# EAGLE schematic microEEG321w (EAGLE 6.5.0)
EEG Processor

## Sheet 1 of 2: Analog Circuitry
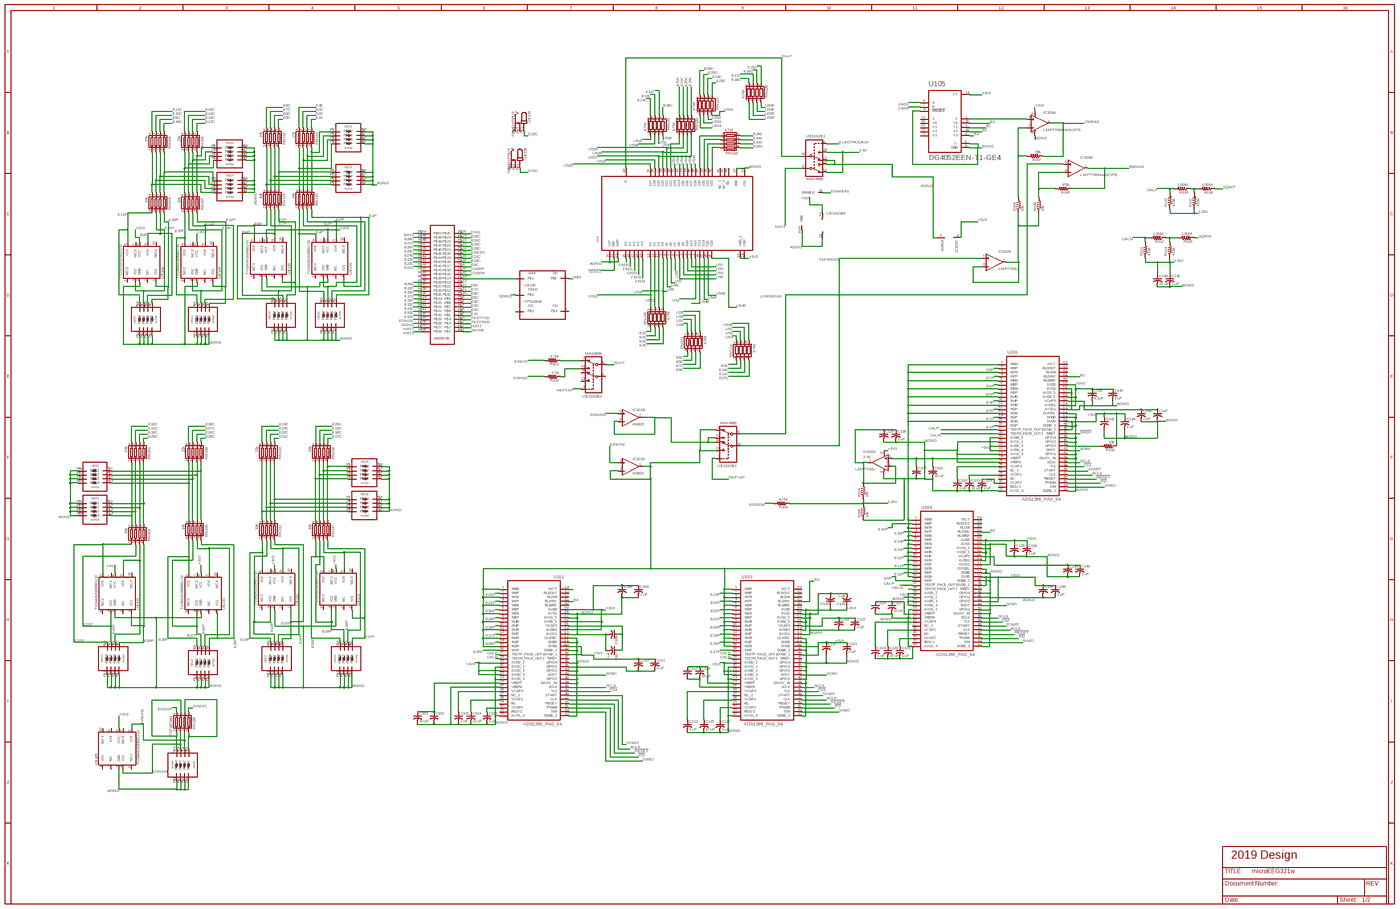
[diagram p0: schematic, sheet 1, overview]
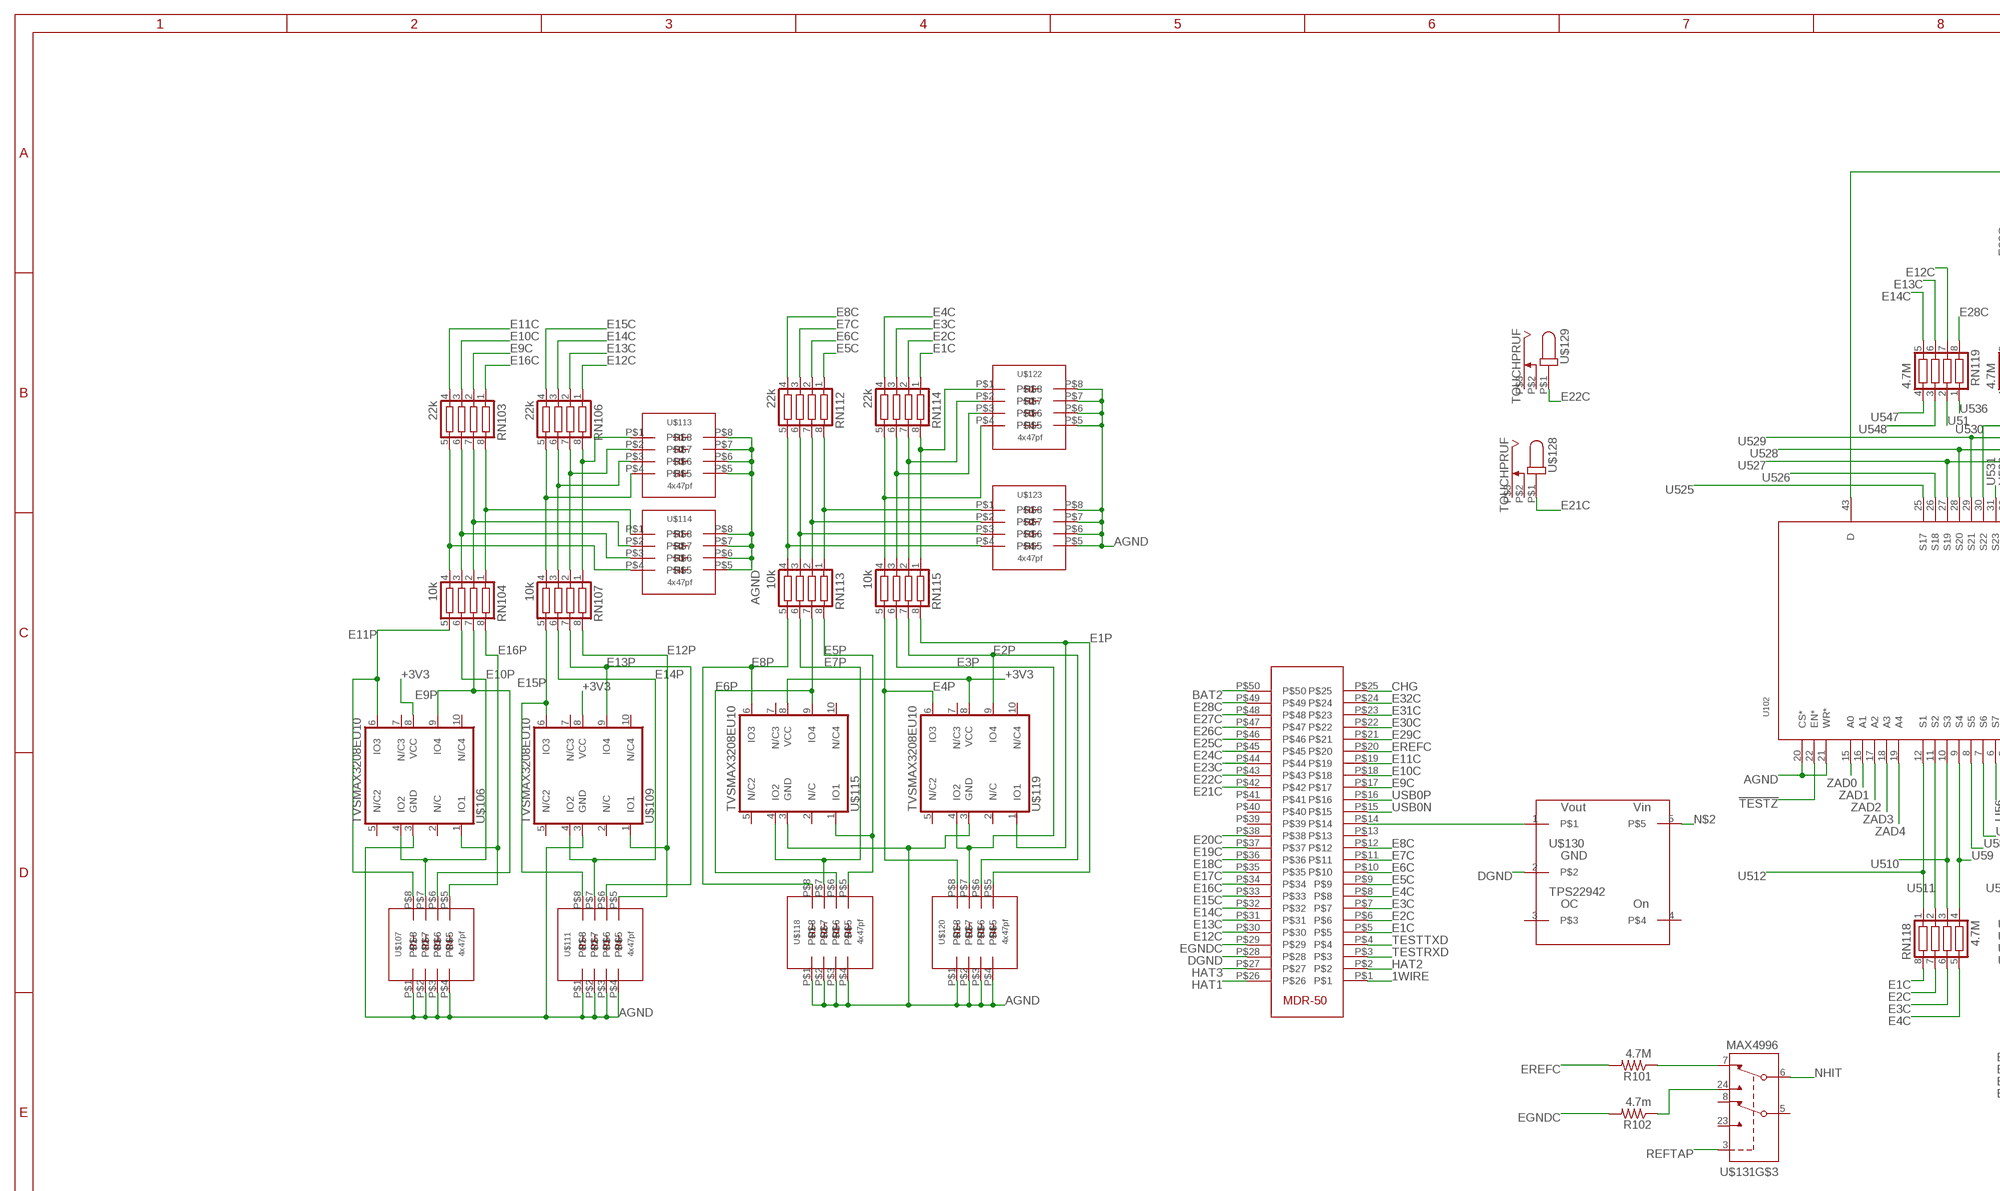
[diagram p1: schematic, sheet 1, part 1 of 4]
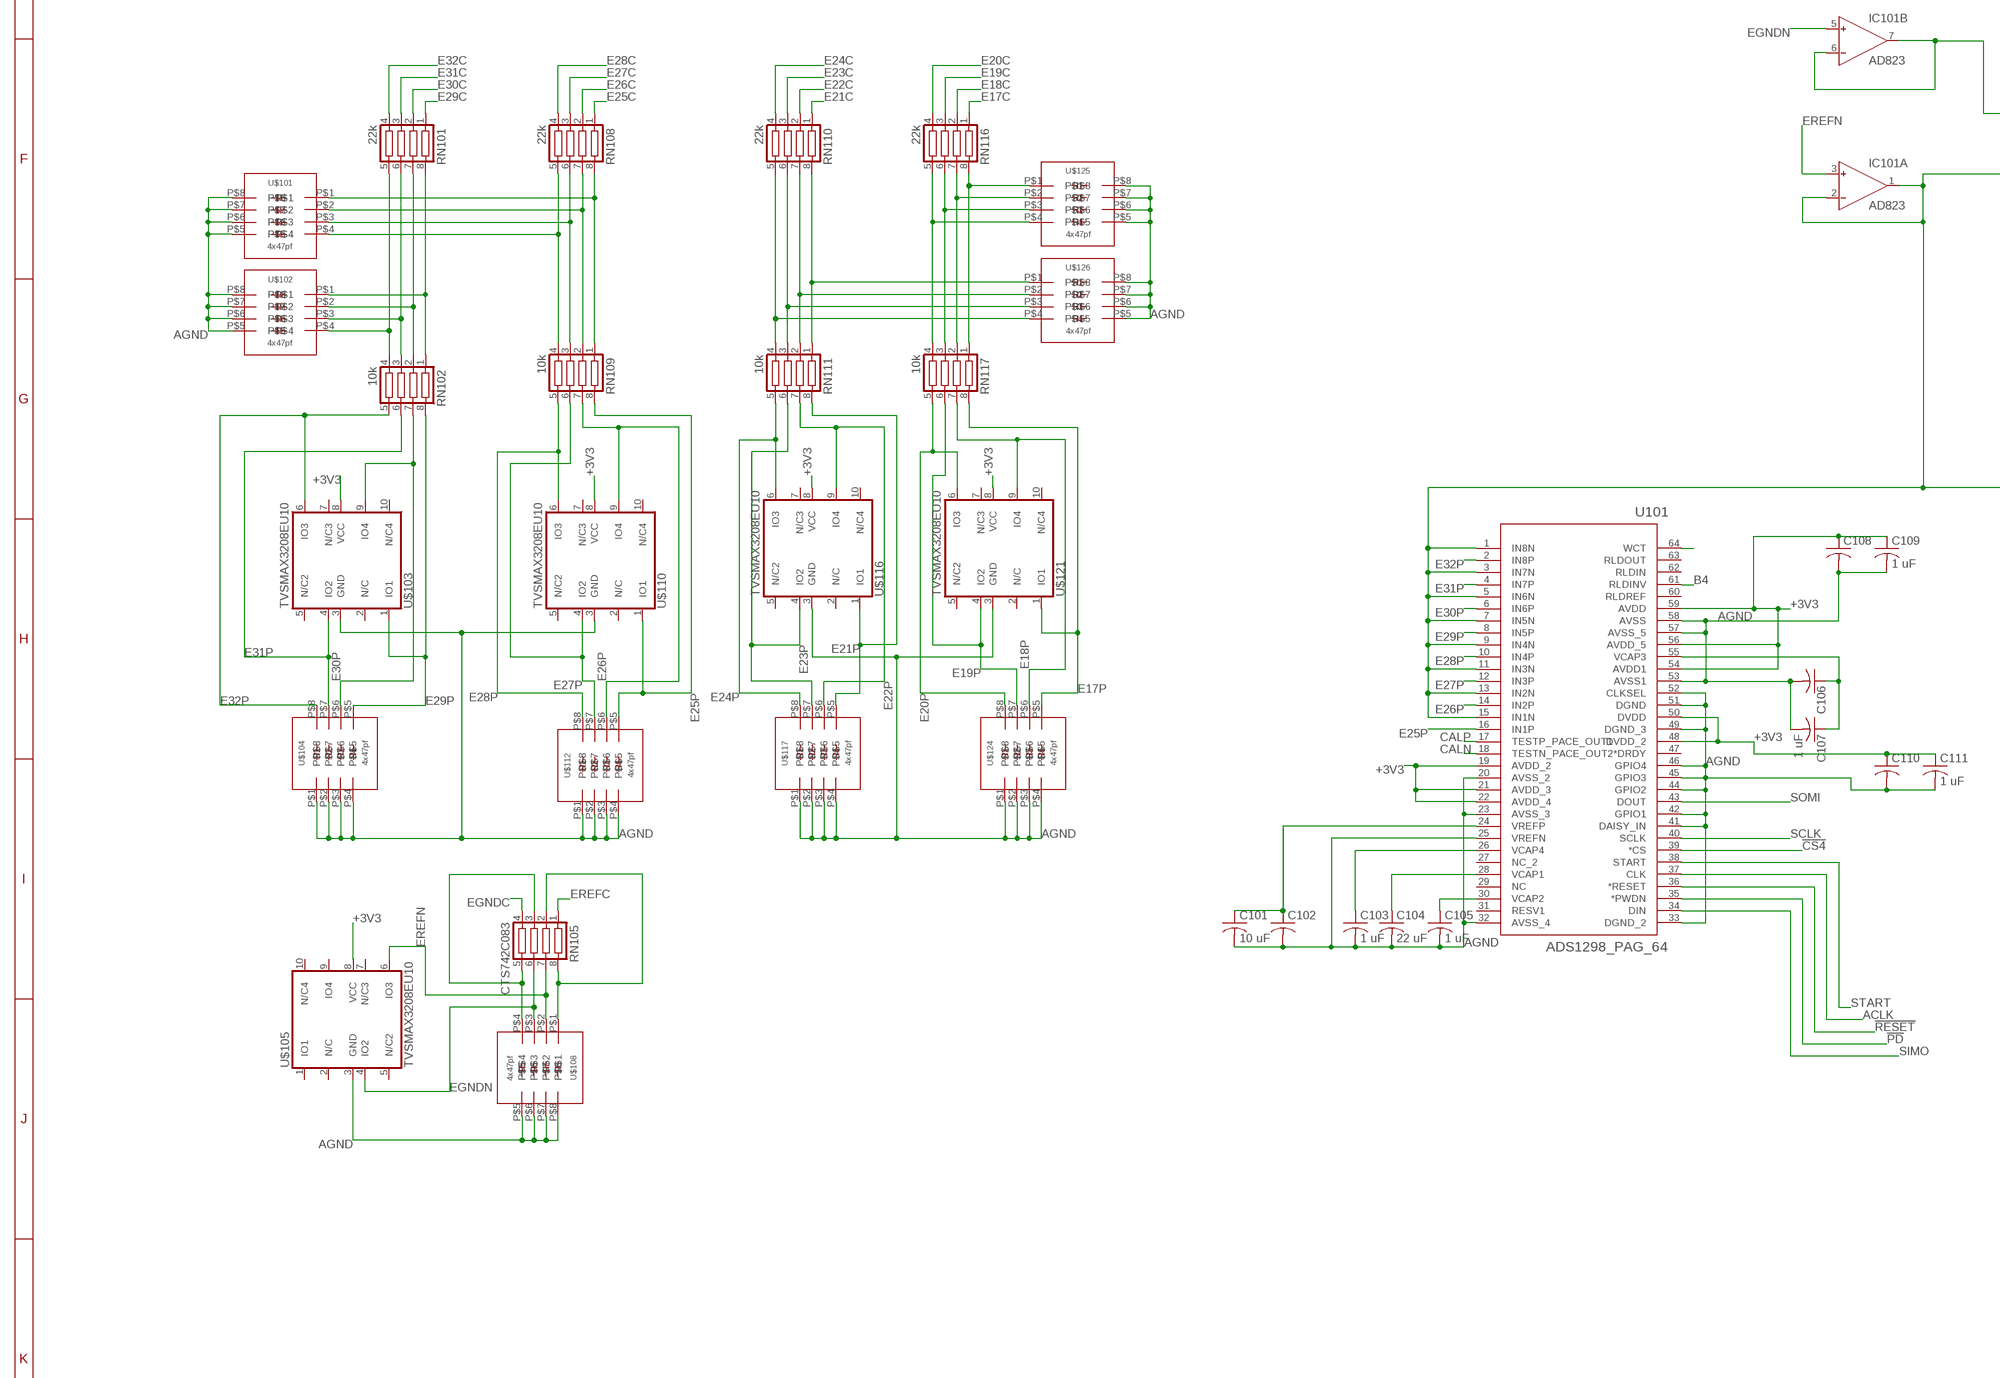
[diagram p2: schematic, sheet 1, part 2 of 4]
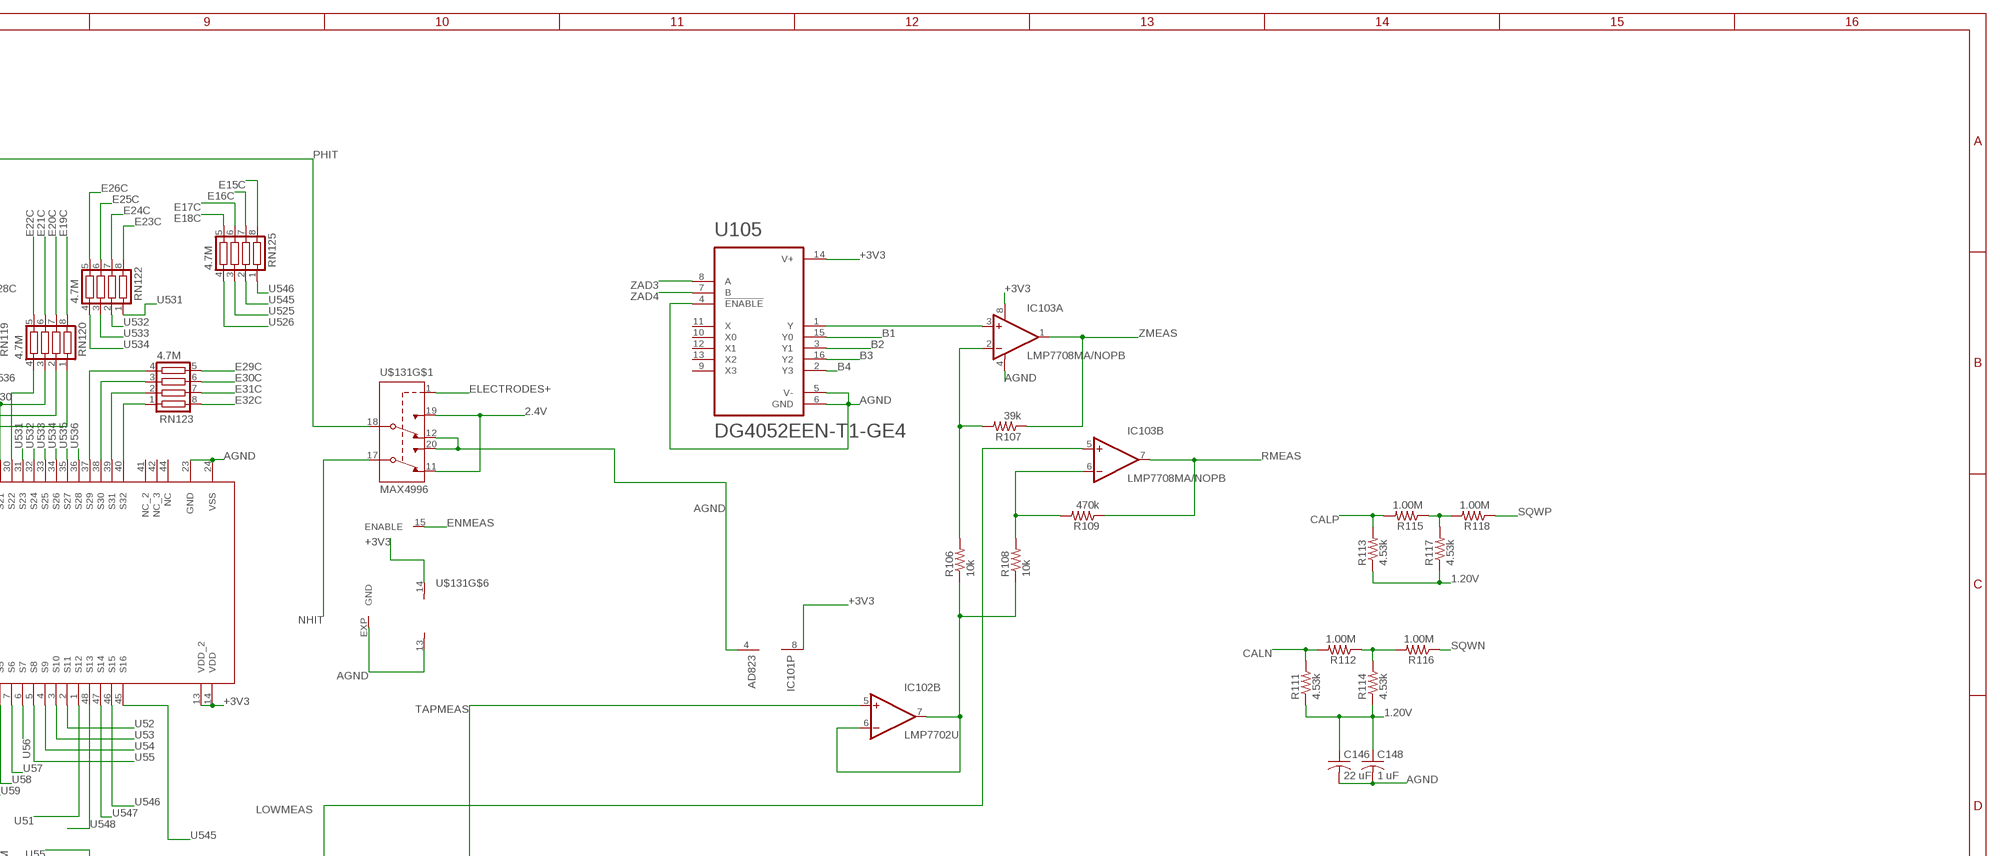
[diagram p3: schematic, sheet 1, part 3 of 4]
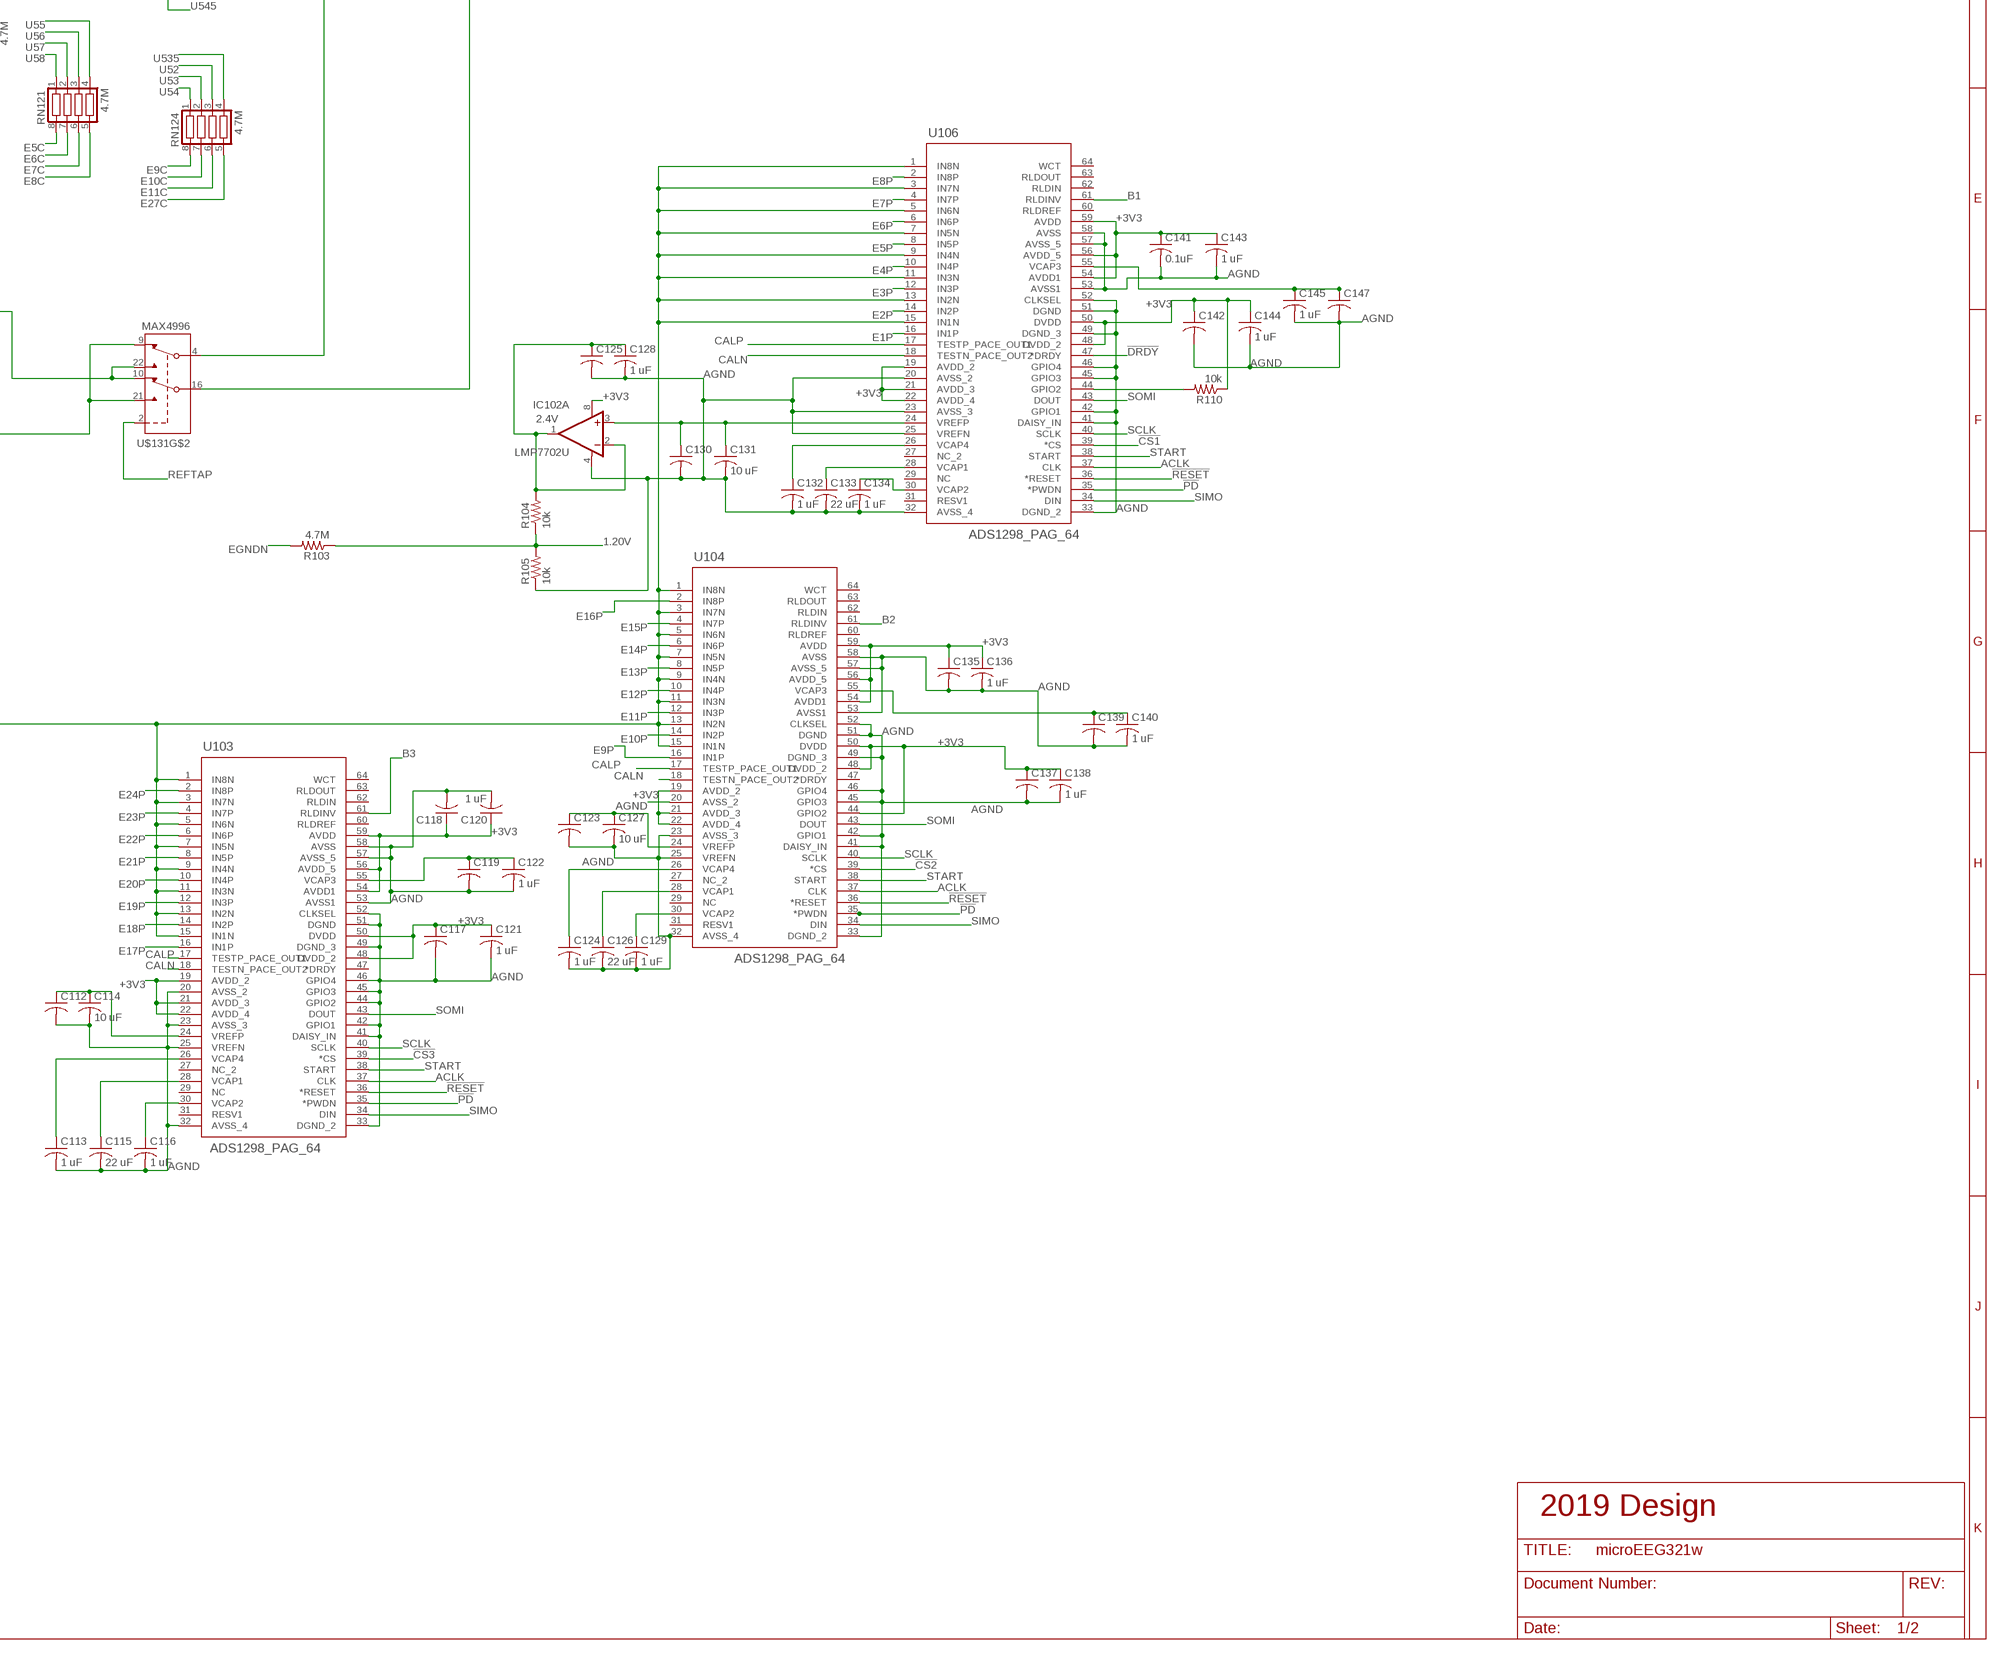
[diagram p4: schematic, sheet 1, part 4 of 4]

### Parts
C101  10 uF  C-USC0402K  [C0402K]
C102  C-USC0402K  [C0402K]
C103  1 uF  C-USC0402K  [C0402K]
C104  22 uF  C-USC0603K  [C0603K]
C105  1 uF  C-USC0402K  [C0402K]
C106  C-USC0402K  [C0402K]
C107  1 uF  C-USC0402K  [C0402K]
C108  C-USC0402K  [C0402K]
C109  1 uF  C-USC0402K  [C0402K]
C110  C-USC0402K  [C0402K]
C111  1 uF  C-USC0402K  [C0402K]
C112  C-USC0402K  [C0402K]
C113  1 uF  C-USC0402K  [C0402K]
C114  10 uF  C-USC0402K  [C0402K]
C115  22 uF  C-USC0603  [C0603]
C116  1 uF  C-USC0402K  [C0402K]
C117  C-USC0402K  [C0402K]
C118  C-USC0402K  [C0402K]
C119  C-USC0402K  [C0402K]
C120  1 uF  C-USC0402K  [C0402K]
C121  1 uF  C-USC0402K  [C0402K]
C122  1 uF  C-USC0402K  [C0402K]
C123  C-USC0402K  [C0402K]
C124  1 uF  C-USC0402K  [C0402K]
C125  C-USC0402K  [C0402K]
C126  22 uF  C-USC0603  [C0603]
C127  10 uF  C-USC0402K  [C0402K]
C128  1 uF  C-USC0402K  [C0402K]
C129  1 uF  C-USC0402K  [C0402K]
C130  C-USC0402K  [C0402K]
C131  10 uF  C-USC0805  [C0805]
C132  1 uF  C-USC0402K  [C0402K]
C133  22 uF  C-USC0603  [C0603]
C134  1 uF  C-USC0402K  [C0402K]
C135  C-USC0402K  [C0402K]
C136  1 uF  C-USC0402K  [C0402K]
C137  C-USC0402K  [C0402K]
C138  1 uF  C-USC0402K  [C0402K]
C139  C-USC0402K  [C0402K]
C140  1 uF  C-USC0402K  [C0402K]
C141  0.1uF  C-USC0402K  [C0402K]
C142  C-USC0402K  [C0402K]
C143  1 uF  C-USC0402K  [C0402K]
C144  1 uF  C-USC0402K  [C0402K]
C145  1 uF  C-USC0402K  [C0402K]
C146  22 uF  C-USC0603  [C0603]
C147  C-USC0402K  [C0402K]
C148  1 uF  C-USC0402  [C0402]
IC101  AD823  [MSOP08]
IC102  LMP7702U  [SO08]
IC103  LMP7708MA/NOPB  LMP7708U  [SO08]
R101  4.7M  R-US_R0402  [R0402]
R102  4.7m  R-US_R0402  [R0402]
R103  4.7M  R-US_R0402  [R0402]
R104  10k  R-US_R0402  [R0402]
R105  10k  R-US_R0402  [R0402]
R106  10k  R-US_R0402  [R0402]
R107  39k  R-US_R0805  [R0805]
R108  10k  R-US_R0402  [R0402]
R109  470k  R-US_R0805  [R0805]
R110  10k  R-US_R0402  [R0402]
R111  4.53k  R-US_R0805  [R0805]
R112  1.00M  R-US_R0402  [R0402]
R113  4.53k  R-US_R0805  [R0805]
R114  4.53k  R-US_R0805  [R0805]
R115  1.00M  R-US_R0402  [R0402]
R116  1.00M  R-US_R0402  [R0402]
R117  4.53k  R-US_R0805  [R0805]
R118  1.00M  R-US_R0402  [R0402]
RN101  22k  CTS742C083  [CTS742C083]
RN102  10k  CTS742C083  [CTS742C083]
RN103  22k  CTS742C083  [CTS742C083]
RN104  10k  CTS742C083  [CTS742C083]
RN105  CTS742C083  [CTS742C083]
RN106  22k  CTS742C083  [CTS742C083]
RN107  10k  CTS742C083  [CTS742C083]
RN108  22k  CTS742C083  [CTS742C083]
RN109  10k  CTS742C083  [CTS742C083]
RN110  22k  CTS742C083  [CTS742C083]
RN111  10k  CTS742C083  [CTS742C083]
RN112  22k  CTS742C083  [CTS742C083]
RN113  10k  CTS742C083  [CTS742C083]
RN114  22k  CTS742C083  [CTS742C083]
RN115  10k  CTS742C083  [CTS742C083]
RN116  22k  CTS742C083  [CTS742C083]
RN117  10k  CTS742C083  [CTS742C083]
RN118  4.7M  CTS742C083  [CTS742C083]
RN119  4.7M  CTS742C083  [CTS742C083]
RN120  4.7M  CTS742C083  [CTS742C083]
RN121  4.7M  CTS742C083  [CTS742C083]
RN122  4.7M  CTS742C083  [CTS742C083]
RN123  4.7M  CTS742C083  [CTS742C083]
RN124  4.7M  CTS742C083  [CTS742C083]
RN125  4.7M  CTS742C083  [CTS742C083]
U101  ADS1298_PAG_64  [PAG64]
U102  ADG732BSUZ  [SU_48]
U103  ADS1298_PAG_64  [PAG64]
U104  ADS1298_PAG_64  [PAG64]
U105  DG4052EEN-T1-GE4  [QFN40P260X180X60-16N]
U106  ADS1298_PAG_64  [PAG64]
U$101  4x47pf  CAP-AVX05084  [CAP0508X4]
U$102  4x47pf  CAP-AVX05084  [CAP0508X4]
U$103  TVSMAX3208EU10  [UMAX10]
U$104  4x47pf  CAP-AVX05084  [CAP0508X4]
U$105  TVSMAX3208EU10  [UMAX10]
U$106  TVSMAX3208EU10  [UMAX10]
U$107  4x47pf  CAP-AVX05084  [CAP0508X4]
U$108  4x47pf  CAP-AVX05084  [CAP0508X4]
U$109  TVSMAX3208EU10  [UMAX10]
U$110  TVSMAX3208EU10  [UMAX10]
U$111  4x47pf  CAP-AVX05084  [CAP0508X4]
U$112  4x47pf  CAP-AVX05084  [CAP0508X4]
U$113  4x47pf  CAP-AVX05084  [CAP0508X4]
U$114  4x47pf  CAP-AVX05084  [CAP0508X4]
U$115  TVSMAX3208EU10  [UMAX10]
U$116  TVSMAX3208EU10  [UMAX10]
U$117  4x47pf  CAP-AVX05084  [CAP0508X4]
U$118  4x47pf  CAP-AVX05084  [CAP0508X4]
U$119  TVSMAX3208EU10  [UMAX10]
U$120  4x47pf  CAP-AVX05084  [CAP0508X4]
U$121  TVSMAX3208EU10  [UMAX10]
U$122  4x47pf  CAP-AVX05084  [CAP0508X4]
U$123  4x47pf  CAP-AVX05084  [CAP0508X4]
U$124  4x47pf  CAP-AVX05084  [CAP0508X4]
U$125  4x47pf  CAP-AVX05084  [CAP0508X4]
U$126  4x47pf  CAP-AVX05084  [CAP0508X4]
U$127  PNLRECEPT  [THROUGHHOLERECEPT]
U$128  TOUCHPRUF  [TOUCHPROOF]
U$129  TOUCHPRUF  [TOUCHPROOF]
U$130  TPS22942  [DCK]
U$131  MAX4996  [TQFN24-EP]

### Nets
1.20V: C146.1 C148.1 R103.1 R104.1 R105.2 R111.1 R113.1 R114.1 R117.1
1WIRE: U$127.P$1 ; also sheet 2
2.4V: C125.1 C128.1 IC102.1(A:OUT) IC102.2(A:-IN) R104.2 U$131.11(NC2) U$131.19(NO1) ; also sheet 2
!CS1!: U106.39(*CS) ; also sheet 2
!CS2!: U104.39(*CS) ; also sheet 2
!CS3!: U103.39(*CS) ; also sheet 2
!CS4!: U101.39(*CS) ; also sheet 2
!DRDY!: U106.47(*DRDY) ; also sheet 2
!PD!: U101.35(*PWDN) U103.35(*PWDN) U104.35(*PWDN) U106.35(*PWDN) ; also sheet 2
!RESET!: U101.36(*RESET) U103.36(*RESET) U104.36(*RESET) U106.36(*RESET) ; also sheet 2
!TESTZ!: U102.22(EN*) ; also sheet 2
+3V3: C108.1 C109.1 C110.1 C111.1 C117.1 C118.1 C120.1 C121.1 C135.1 C136.1 C137.1 C138.1 C141.1 C142.1 C143.1 C144.1 IC101.8(P:V+) IC102.8(A:V+) IC103.8(A:V+) R110.1 U101.19(AVDD_2) U101.21(AVDD_3) U101.22(AVDD_4) U101.48(DVDD_2) U101.50(DVDD) U101.54(AVDD1) U101.56(AVDD_5) U101.59(AVDD) U102.13(VDD_2) U102.14(VDD) U103.19(AVDD_2) U103.21(AVDD_3) U103.22(AVDD_4) U103.48(DVDD_2) U103.50(DVDD) U103.54(AVDD1) U103.56(AVDD_5) U103.59(AVDD) U104.19(AVDD_2) U104.21(AVDD_3) U104.22(AVDD_4) U104.44(GPIO2) U104.48(DVDD_2) U104.50(DVDD) U104.54(AVDD1) U104.56(AVDD_5) U104.59(AVDD) U105.14(V+) U106.19(AVDD_2) U106.21(AVDD_3) U106.22(AVDD_4) U106.48(DVDD_2) U106.50(DVDD) U106.54(AVDD1) U106.56(AVDD_5) U106.59(AVDD) U$103.8(VCC) U$105.8(VCC) U$106.8(VCC) U$109.8(VCC) U$110.8(VCC) U$115.8(VCC) U$116.8(VCC) U$119.8(VCC) U$121.8(VCC) U$131.14(V+) ; also sheet 2
ACLK: U101.37(CLK) U103.37(CLK) U104.37(CLK) U106.37(CLK) ; also sheet 2
AGND: C101.2 C102.2 C103.2 C104.2 C105.2 C106.2 C107.2 C108.2 C109.2 C110.2 C111.2 C112.2 C113.2 C114.2 C115.2 C116.2 C117.2 C118.2 C119.2 C120.2 C121.2 C122.2 C123.2 C124.2 C125.2 C126.2 C127.2 C128.2 C129.2 C130.2 C131.2 C132.2 C133.2 C134.2 C135.2 C136.2 C137.2 C138.2 C139.2 C140.2 C141.2 C142.2 C143.2 C144.2 C145.2 C146.2 C147.2 C148.2 IC101.4(P:V-) IC102.4(A:V-) IC103.4(A:V-) R105.1 U101.20(AVSS_2) U101.23(AVSS_3) U101.25(VREFN) U101.32(AVSS_4) U101.33(DGND_2) U101.41(DAISY_IN) U101.42(GPIO1) U101.44(GPIO2) U101.45(GPIO3) U101.46(GPIO4) U101.49(DGND_3) U101.51(DGND) U101.52(CLKSEL) U101.53(AVSS1) U101.57(AVSS_5) U101.58(AVSS) U102.20(CS*) U102.21(WR*) U102.23(GND) U102.24(VSS) U103.20(AVSS_2) U103.23(AVSS_3) U103.25(VREFN) U103.32(AVSS_4) U103.33(DGND_2) U103.41(DAISY_IN) U103.42(GPIO1) U103.44(GPIO2) U103.45(GPIO3) U103.46(GPIO4) U103.49(DGND_3) U103.51(DGND) U103.52(CLKSEL) U103.53(AVSS1) U103.57(AVSS_5) U103.58(AVSS) U104.20(AVSS_2) U104.23(AVSS_3) U104.25(VREFN) U104.32(AVSS_4) U104.33(DGND_2) U104.41(DAISY_IN) U104.42(GPIO1) U104.45(GPIO3) U104.46(GPIO4) U104.49(DGND_3) U104.51(DGND) U104.52(CLKSEL) U104.53(AVSS1) U104.57(AVSS_5) U104.58(AVSS) U105.4(!ENABLE) U105.5(V-) U105.6(GND) U106.20(AVSS_2) U106.23(AVSS_3) U106.25(VREFN) U106.32(AVSS_4) U106.33(DGND_2) U106.41(DAISY_IN) U106.42(GPIO1) U106.45(GPIO3) U106.46(GPIO4) U106.49(DGND_3) U106.51(DGND) U106.52(CLKSEL) U106.53(AVSS1) U106.57(AVSS_5) U106.58(AVSS) U$101.P$5 U$101.P$6 U$101.P$7 U$101.P$8 U$102.P$5 U$102.P$6 U$102.P$7 U$102.P$8 U$103.3(GND) U$104.P$1 U$104.P$2 U$104.P$3 U$104.P$4 U$105.3(GND) U$106.3(GND) U$107.P$1 U$107.P$2 U$107.P$3 U$107.P$4 U$108.P$5 U$108.P$6 U$108.P$7 U$108.P$8 U$109.3(GND) U$110.3(GND) U$111.P$1 U$111.P$2 U$111.P$3 U$111.P$4 U$112.P$1 U$112.P$2 U$112.P$3 U$112.P$4 U$113.P$5 U$113.P$6 U$113.P$7 U$113.P$8 U$114.P$5 U$114.P$6 U$114.P$7 U$114.P$8 U$115.3(GND) U$116.3(GND) U$117.P$1 U$117.P$2 U$117.P$3 U$117.P$4 U$118.P$1 U$118.P$2 U$118.P$3 U$118.P$4 U$119.3(GND) U$120.P$1 U$120.P$2 U$120.P$3 U$120.P$4 U$121.3(GND) U$122.P$5 U$122.P$6 U$122.P$7 U$122.P$8 U$123.P$5 U$123.P$6 U$123.P$7 U$123.P$8 U$124.P$1 U$124.P$2 U$124.P$3 U$124.P$4 U$125.P$5 U$125.P$6 U$125.P$7 U$125.P$8 U$126.P$5 U$126.P$6 U$126.P$7 U$126.P$8 U$131.12(NC1) U$131.13(V-) U$131.20(NO2) U$131.EXP(GND) ; also sheet 2
B1: U105.15(Y0) U106.61(RLDINV)
B2: U104.61(RLDINV) U105.3(Y1)
B3: U103.61(RLDINV) U105.16(Y2)
B4: U101.61(RLDINV) U105.2(Y3)
BAT2: U$127.P$50 ; also sheet 2
CALN: R111.2 R112.2 U101.18(TESTN_PACE_OUT2) U103.18(TESTN_PACE_OUT2) U104.18(TESTN_PACE_OUT2) U106.18(TESTN_PACE_OUT2)
CALP: R113.2 R115.2 U101.17(TESTP_PACE_OUT1) U103.17(TESTP_PACE_OUT1) U104.17(TESTP_PACE_OUT1) U106.17(TESTP_PACE_OUT1)
CHG: U$127.P$25 ; also sheet 2
DGND: U$127.P$28 U$130.2 ; also sheet 2
E1C: RN114.1 RN118.8 U$127.P$5
E1P: RN115.8 U106.16(IN1P) U$119.1(IO1) U$120.P$5
E2C: RN114.2 RN118.7 U$127.P$6
E2P: RN115.7 U106.14(IN2P) U$119.9(IO4) U$120.P$6
E3C: RN114.3 RN118.6 U$127.P$7
E3P: RN115.6 U106.12(IN3P) U$119.4(IO2) U$120.P$7
E4C: RN114.4 RN118.5 U$127.P$8
E4P: RN115.5 U106.10(IN4P) U$119.6(IO3) U$120.P$8
E5C: RN112.1 RN121.8 U$127.P$9
E5P: RN113.8 U106.8(IN5P) U$115.1(IO1) U$118.P$5
E6C: RN112.2 RN121.7 U$127.P$10
E6P: RN113.7 U106.6(IN6P) U$115.9(IO4) U$118.P$6
E7C: RN112.3 RN121.6 U$127.P$11
E7P: RN113.6 U106.4(IN7P) U$115.4(IO2) U$118.P$7
E8C: RN112.4 RN121.5 U$127.P$12
E8P: RN113.5 U106.2(IN8P) U$115.6(IO3) U$118.P$8
E9C: RN103.2 RN124.8 U$127.P$17
E9P: RN104.7 U104.16(IN1P) U$106.9(IO4) U$107.P$6
E10C: RN103.3 RN124.7 U$127.P$18
E10P: RN104.6 U104.14(IN2P) U$106.4(IO2) U$107.P$7
E11C: RN103.4 RN124.6 U$127.P$19
E11P: RN104.5 U104.12(IN3P) U$106.6(IO3) U$107.P$8
E12C: RN106.1 RN119.7 U$127.P$30
E12P: RN107.8 U104.10(IN4P) U$109.1(IO1) U$111.P$5
E13C: RN106.2 RN119.6 U$127.P$31
E13P: RN107.7 U104.8(IN5P) U$109.9(IO4) U$111.P$6
E14C: RN106.3 RN119.5 U$127.P$32
E14P: RN107.6 U104.6(IN6P) U$109.4(IO2) U$111.P$7
E15C: RN106.4 RN125.8 U$127.P$33
E15P: RN107.5 U104.4(IN7P) U$109.6(IO3) U$111.P$8
E16C: RN103.1 RN125.7 U$127.P$34
E16P: RN104.8 U104.2(IN8P) U$106.1(IO1) U$107.P$5
E17C: RN116.1 RN125.6 U$127.P$35
E17P: RN117.8 U103.16(IN1P) U$121.1(IO1) U$124.P$5
E18C: RN116.2 RN125.5 U$127.P$36
E18P: RN117.7 U103.14(IN2P) U$121.9(IO4) U$124.P$6
E19C: RN116.3 RN120.8 U$127.P$37
E19P: RN117.6 U103.12(IN3P) U$121.4(IO2) U$124.P$7
E20C: RN116.4 RN120.7 U$127.P$38
E20P: RN117.5 U103.10(IN4P) U$121.6(IO3) U$124.P$8
E21C: RN110.1 RN120.6 U$127.P$42 U$128.P$1
E21P: RN111.8 U103.8(IN5P) U$116.1(IO1) U$117.P$5
E22C: RN110.2 RN120.5 U$127.P$43 U$129.P$1
E22P: RN111.7 U103.6(IN6P) U$116.9(IO4) U$117.P$6
E23C: RN110.3 RN122.8 U$127.P$44
E23P: RN111.6 U103.4(IN7P) U$116.4(IO2) U$117.P$7
E24C: RN110.4 RN122.7 U$127.P$45
E24P: RN111.5 U103.2(IN8P) U$116.6(IO3) U$117.P$8
E25C: RN108.1 RN122.6 U$127.P$46
E25P: RN109.8 U101.16(IN1P) U$110.1(IO1) U$112.P$5
E26C: RN108.2 RN122.5 U$127.P$47
E26P: RN109.7 U101.14(IN2P) U$110.9(IO4) U$112.P$6
E27C: RN108.3 RN124.5 U$127.P$48
E27P: RN109.6 U101.12(IN3P) U$110.4(IO2) U$112.P$7
E28C: RN108.4 RN119.8 U$127.P$49
E28P: RN109.5 U101.10(IN4P) U$110.6(IO3) U$112.P$8
E29C: RN101.1 RN123.5 U$127.P$21
E29P: RN102.8 U101.8(IN5P) U$103.1(IO1) U$104.P$5
E30C: RN101.2 RN123.6 U$127.P$22
E30P: RN102.7 U101.6(IN6P) U$103.9(IO4) U$104.P$6
E31C: RN101.3 RN123.7 U$127.P$23
E31P: RN102.6 U101.4(IN7P) U$103.4(IO2) U$104.P$7
E32C: RN101.4 RN123.8 U$127.P$24
E32P: RN102.5 U101.2(IN8P) U$103.6(IO3) U$104.P$8
EGNDC: R102.2 RN105.4 U$127.P$29
EGNDN: IC101.5(B:IN+) R103.2 RN105.6 U$105.4(IO2) U$108.P$3
ELECTRODES+: U$131.1(CB) ; also sheet 2
ENMEAS: U$131.15(ENABLE) ; also sheet 2
EREFC: R101.2 RN105.1 U$127.P$20
EREFN: IC101.3(A:IN+) RN105.7 U$105.6(IO3) U$108.P$2
HAT1: U$127.P$26 ; also sheet 2
HAT2: U$127.P$2 ; also sheet 2
HAT3: U$127.P$27 ; also sheet 2
LOWMEAS: IC103.5(B:+IN) U$131.4(COM2)
N$1: R110.2 U106.44(GPIO2)
N$2: U$130.5 ; also sheet 2
N$6: R101.1 U$131.7(NC2)
N$7: IC103.3(A:+IN) U105.1(Y)
N$8: R102.1 U$131.24(NO2)
N$9: RN112.5 RN113.4 U$123.P$4
N$10: IC101.6(B:IN-) IC101.7(B:OUT) U$131.10(NC1) U$131.22(NO2)
N$16: RN123.4 U102.37(S29)
N$17: RN112.6 RN113.3 U$123.P$3
N$18: RN112.7 RN113.2 U$123.P$2
N$21: RN123.3 U102.38(S30)
N$22: RN123.2 U102.39(S31)
N$23: RN123.1 U102.40(S32)
N$24: RN112.8 RN113.1 U$123.P$1
N$31: RN105.2 RN105.8 U$108.P$1
N$32: RN106.8 RN107.1 U$113.P$1
N$33: RN106.7 RN107.2 U$113.P$2
N$34: RN106.6 RN107.3 U$113.P$3
N$36: RN106.5 RN107.4 U$113.P$4
N$37: RN103.8 RN104.1 U$114.P$1
N$38: RN114.8 RN115.1 U$122.P$1
N$39: RN114.7 RN115.2 U$122.P$2
N$40: RN114.6 RN115.3 U$122.P$3
N$41: RN114.5 RN115.4 U$122.P$4
N$44: RN103.7 RN104.2 U$114.P$2
N$45: RN103.6 RN104.3 U$114.P$3
N$46: RN103.5 RN104.4 U$114.P$4
N$55: C130.1 C131.1 IC102.3(A:+IN) U106.24(VREFP)
N$58: RN116.8 RN117.1 U$125.P$1
N$59: RN116.7 RN117.2 U$125.P$2
N$60: RN116.6 RN117.3 U$125.P$3
N$61: RN116.5 RN117.4 U$125.P$4
N$62: IC102.6(B:-IN) IC102.7(B:OUT) R106.1 R108.1
N$63: IC103.6(B:-IN) R108.2 R109.2
N$64: IC103.2(A:-IN) R106.2 R107.2
N$65: RN101.5 RN102.4 U$102.P$4
N$69: C105.1 U101.30(VCAP2)
N$70: C145.1 C147.1 U106.55(VCAP3)
N$71: C101.1 C102.1 U101.24(VREFP)
N$72: RN110.8 RN111.1 U$126.P$1
N$73: RN110.7 RN111.2 U$126.P$2
N$74: RN110.6 RN111.3 U$126.P$3
N$75: C104.1 U101.28(VCAP1)
N$76: C106.1 C107.1 U101.55(VCAP3)
N$77: C103.1 U101.26(VCAP4)
N$78: C116.1 U103.30(VCAP2)
N$79: C115.1 U103.28(VCAP1)
N$80: C113.1 U103.26(VCAP4)
N$81: C123.1 C127.1 U104.24(VREFP)
N$82: C129.1 U104.30(VCAP2)
N$83: C126.1 U104.28(VCAP1)
N$84: C124.1 U104.26(VCAP4)
N$85: C134.1 U106.30(VCAP2)
N$86: C133.1 U106.28(VCAP1)
N$87: C132.1 U106.26(VCAP4)
N$90: RN110.5 RN111.4 U$126.P$4
N$92: RN101.6 RN102.3 U$102.P$3
N$93: RN101.7 RN102.2 U$102.P$2
N$95: RN101.8 RN102.1 U$102.P$1
N$96: RN108.5 RN109.4 U$101.P$4
N$99: RN108.6 RN109.3 U$101.P$3
N$104: RN108.7 RN109.2 U$101.P$2
N$107: RN108.8 RN109.1 U$101.P$1
N$111: R115.1 R117.2 R118.2
N$112: R112.1 R114.2 R116.2
N$130: C139.1 C140.1 U104.55(VCAP3)
N$132: U$127.P$14 U$130.1
N$133: C112.1 C114.1 U103.24(VREFP)
N$145: C119.1 C122.1 U103.55(VCAP3)
N$147: RN105.3 RN105.5 U$108.P$4
NCOMM: IC101.1(A:OUT) IC101.2(A:IN-) U101.1(IN8N) U101.3(IN7N) U101.5(IN6N) U101.7(IN5N) U101.9(IN4N) U101.11(IN3N) U101.13(IN2N) U101.15(IN1N) U103.1(IN8N) U103.3(IN7N) U103.5(IN6N) U103.7(IN5N) U103.9(IN4N) U103.11(IN3N) U103.13(IN2N) U103.15(IN1N) U104.1(IN8N) U104.3(IN7N) U104.5(IN6N) U104.7(IN5N) U104.9(IN4N) U104.11(IN3N) U104.13(IN2N) U104.15(IN1N) U106.1(IN8N) U106.3(IN7N) U106.5(IN6N) U106.7(IN5N) U106.9(IN4N) U106.11(IN3N) U106.13(IN2N) U106.15(IN1N) U$131.9(NC2) U$131.21(NO1)
NHIT: U$131.6(COM2) U$131.17(COM2)
PHIT: U102.43(D) U$131.18(COM1)
REFTAP: U$131.2(CB) U$131.3(CB) ; also sheet 2
RMEAS: IC103.7(B:OUT) R109.1 ; also sheet 2
SCLK: U101.40(SCLK) U103.40(SCLK) U104.40(SCLK) U106.40(SCLK) ; also sheet 2
SIMO: U101.34(DIN) U103.34(DIN) U104.34(DIN) U106.34(DIN) ; also sheet 2
SOMI: U101.43(DOUT) U103.43(DOUT) U104.43(DOUT) U106.43(DOUT) ; also sheet 2
SQWN: R116.1 ; also sheet 2
SQWP: R118.1 ; also sheet 2
START: U101.38(START) U103.38(START) U104.38(START) U106.38(START) ; also sheet 2
TAPMEAS: IC102.5(B:+IN) U$131.16(COM1)
TESTRXD: U$127.P$3 ; also sheet 2
TESTTXD: U$127.P$4 ; also sheet 2
U51: RN119.2 U102.1(S12)
U52: RN124.3 U102.2(S11)
U53: RN124.2 U102.3(S10)
U54: RN124.1 U102.4(S9)
U55: RN121.4 U102.5(S8)
U56: RN121.3 U102.6(S7)
U57: RN121.2 U102.7(S6)
U58: RN121.1 U102.8(S5)
U59: RN118.4 U102.9(S4)
U510: RN118.3 U102.10(S3)
U511: RN118.2 U102.11(S2)
U512: RN118.1 U102.12(S1)
U525: RN125.3 U102.25(S17)
U526: RN125.4 U102.26(S18)
U527: RN120.1 U102.27(S19)
U528: RN120.2 U102.28(S20)
U529: RN120.3 U102.29(S21)
U530: RN120.4 U102.30(S22)
U531: RN122.1 U102.31(S23)
U532: RN122.2 U102.32(S24)
U533: RN122.3 U102.33(S25)
U534: RN122.4 U102.34(S26)
U535: RN124.4 U102.35(S27)
U536: RN119.1 U102.36(S28)
U545: RN125.2 U102.45(S16)
U546: RN125.1 U102.46(S15)
U547: RN119.4 U102.47(S14)
U548: RN119.3 U102.48(S13)
USB0N: U$127.P$15 ; also sheet 2
USB0P: U$127.P$16 ; also sheet 2
WCT: U101.64(WCT)
ZAD0: U102.15(A0) ; also sheet 2
ZAD1: U102.16(A1) ; also sheet 2
ZAD2: U102.17(A2) ; also sheet 2
ZAD3: U102.18(A3) U105.8(A) ; also sheet 2
ZAD4: U102.19(A4) U105.7(B) ; also sheet 2
ZMEAS: IC103.1(A:OUT) R107.1 ; also sheet 2
Unconnected: U101.27(NC_2) U101.29(NC) U101.31(RESV1) U101.47(*DRDY) U101.60(RLDREF) U101.62(RLDIN) U101.63(RLDOUT) U102.41(NC_2) U102.42(NC_3) U102.44(NC) U103.27(NC_2) U103.29(NC) U103.31(RESV1) U103.47(*DRDY) U103.60(RLDREF) U103.62(RLDIN) U103.63(RLDOUT) U103.64(WCT) U104.27(NC_2) U104.29(NC) U104.31(RESV1) U104.47(*DRDY) U104.60(RLDREF) U104.62(RLDIN) U104.63(RLDOUT) U104.64(WCT) U105.9(X3) U105.10(X0) U105.11(X) U105.12(X1) U105.13(X2) U106.27(NC_2) U106.29(NC) U106.31(RESV1) U106.60(RLDREF) U106.62(RLDIN) U106.63(RLDOUT) U106.64(WCT) U$103.2(N/C) U$103.5(N/C2) U$103.7(N/C3) U$103.10(N/C4) U$105.1(IO1) U$105.2(N/C) U$105.5(N/C2) U$105.7(N/C3) U$105.9(IO4) U$105.10(N/C4) U$106.2(N/C) U$106.5(N/C2) U$106.7(N/C3) U$106.10(N/C4) U$109.2(N/C) U$109.5(N/C2) U$109.7(N/C3) U$109.10(N/C4) U$110.2(N/C) U$110.5(N/C2) U$110.7(N/C3) U$110.10(N/C4) U$115.2(N/C) U$115.5(N/C2) U$115.7(N/C3) U$115.10(N/C4) U$116.2(N/C) U$116.5(N/C2) U$116.7(N/C3) U$116.10(N/C4) U$119.2(N/C) U$119.5(N/C2) U$119.7(N/C3) U$119.10(N/C4) U$121.2(N/C) U$121.5(N/C2) U$121.7(N/C3) U$121.10(N/C4) U$127.P$13 U$127.P$39 U$127.P$40 U$127.P$41 U$128.P$2 U$128.P$3 U$129.P$2 U$129.P$3 U$130.3 U$130.4 U$131.5(COM1) U$131.8(NC1) U$131.23(NO1)

### Notes on the sheet
- 2019 Design

## Sheet 2 of 2: Digital Processing
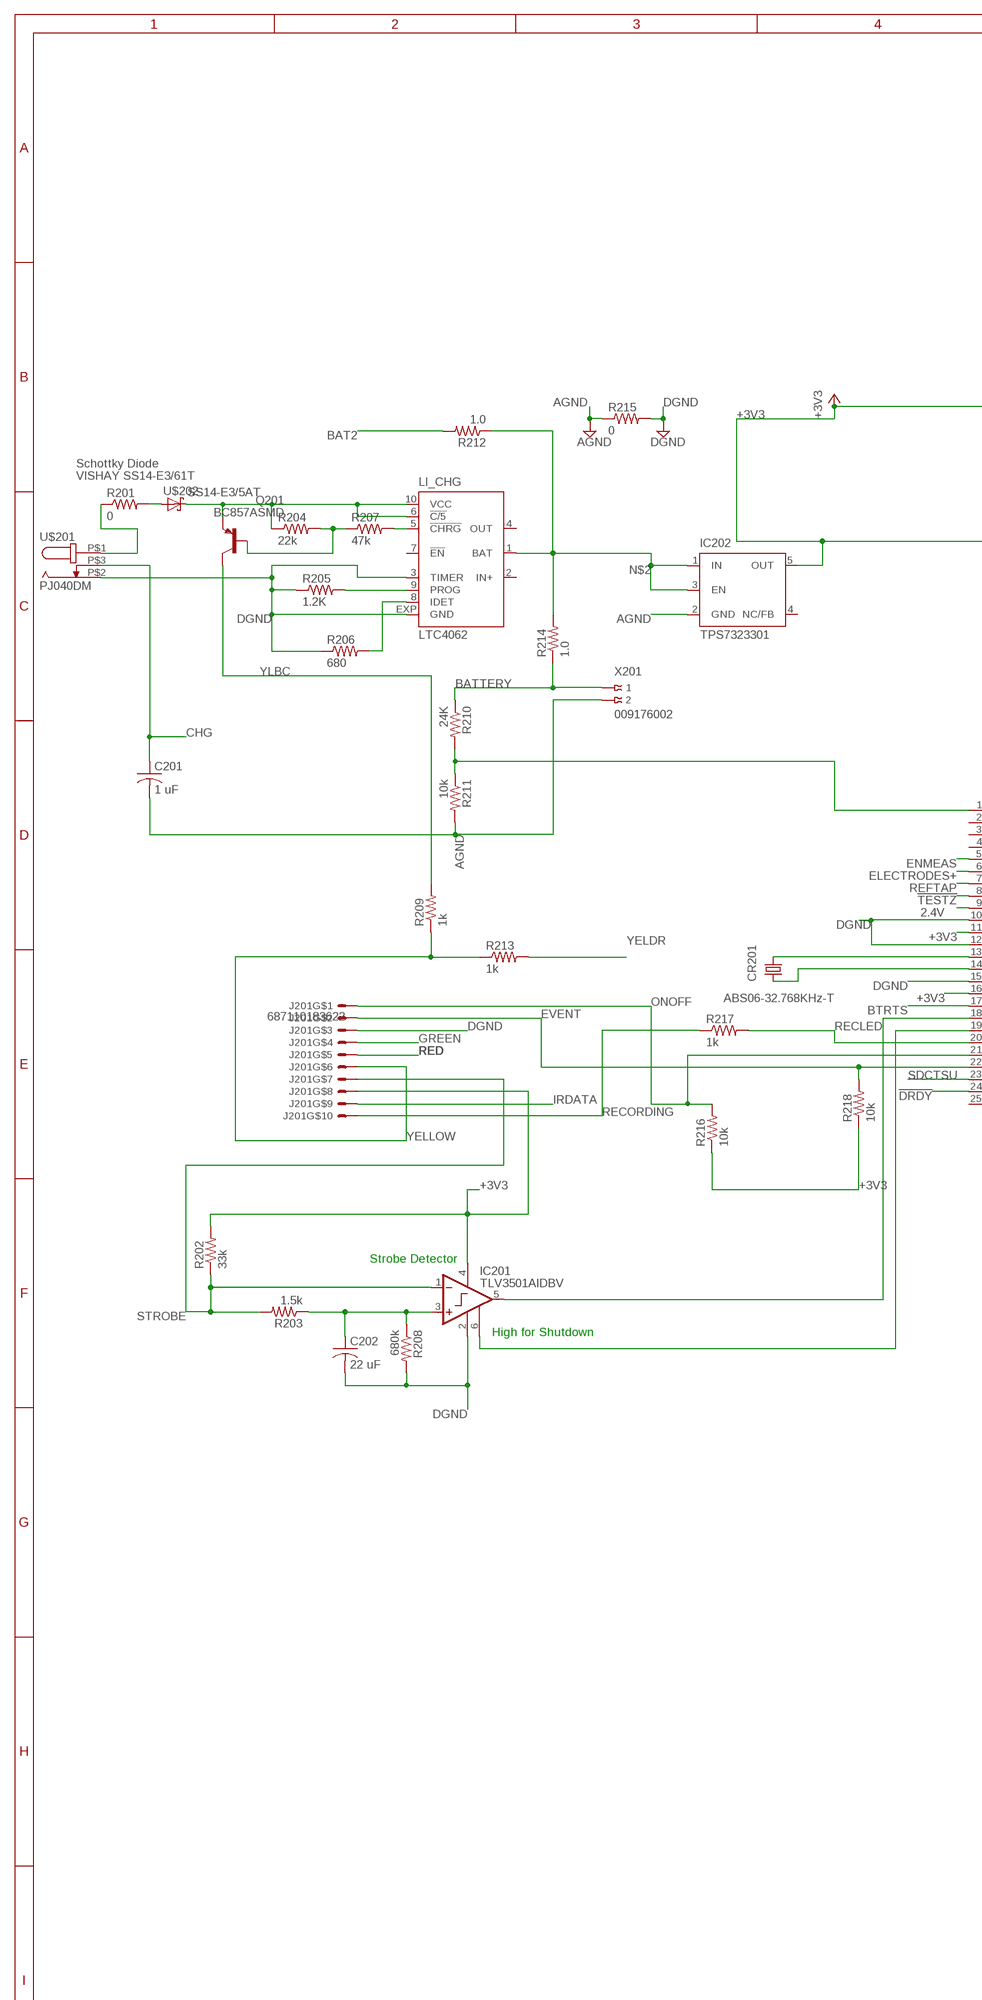
[diagram p5: schematic, sheet 2, part 1 of 2]
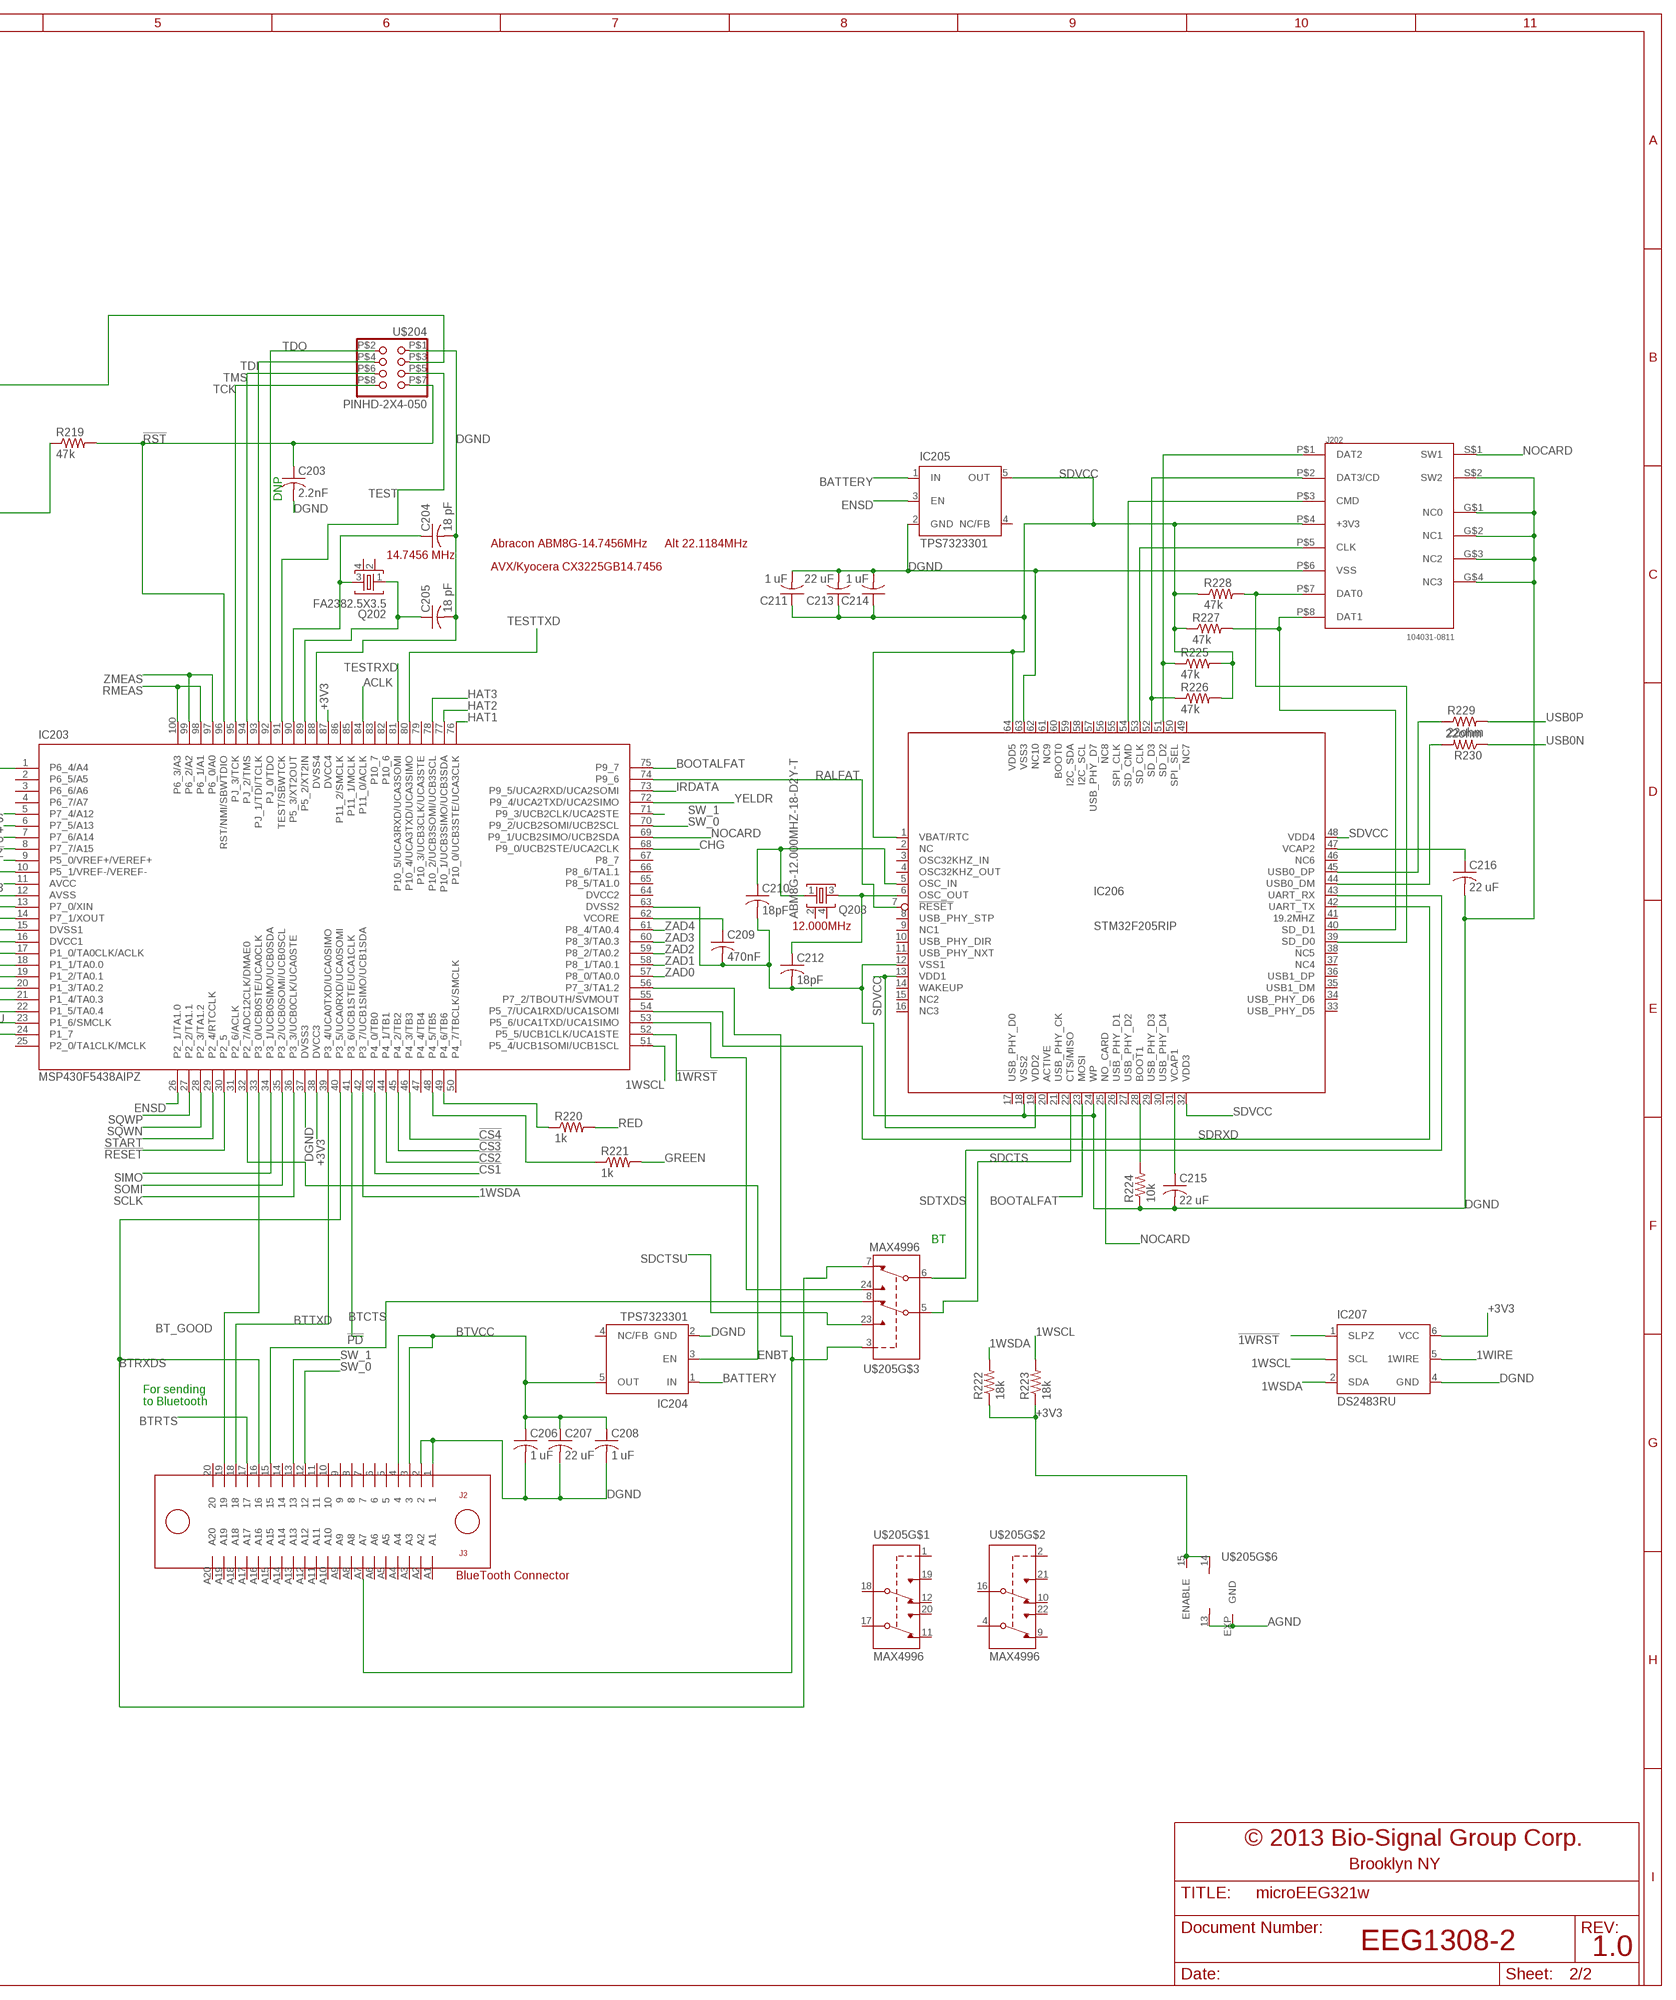
[diagram p6: schematic, sheet 2, part 2 of 2]

### Parts
C201  1 uF  C-USC0402K  [C0402K]
C202  22 uF  C-USC0603K  [C0603K]
C203  2.2nF  C-USC0603  [C0603]
C204  18 pF  C-USC0603  [C0603]
C205  18 pF  C-USC0603  [C0603]
C206  1 uF  C-USC0402K  [C0402K]
C207  22 uF  C-USC0603K  [C0603K]
C208  1 uF  C-USC0402K  [C0402K]
C209  470nF  C-USC0402  [C0402]
C210  18pF  C-USC0402K  [C0402K]
C211  1 uF  C-USC0402K  [C0402K]
C212  18pF  C-USC0402K  [C0402K]
C213  22 uF  C-USC0603K  [C0603K]
C214  1 uF  C-USC0402K  [C0402K]
C215  22 uF  C-USC0603K  [C0603K]
C216  22 uF  C-USC0603  [C0603]
CR201  ABS06-32.768KHz-T  FC-12M  [FC-12M]
IC201  TLV3501AIDBV  [SOT23-6]
IC202  TPS7323301  [SOT23-DBV]
IC203  MSP430F5438AIPZ  MSP430F5438  [PZ_S-PQFP-G100]
IC204  TPS7323301  [SOT23-DBV]
IC205  TPS7323301  [SOT23-DBV]
IC206  STM32F205RIP  [SQFP-S-10X10-64]
IC207  DS2483RU  MAX6342  [SOT23-6L]
J201  687110183622  [XF2L-1025-1]
J202  104031-0811  MICROSD_HOLDER  [MOLEX_SD]
LI_CHG  LTC4062  [DFN10-3X3]
Q201  BC857ASMD  [SOT23-BEC]
Q202  FA2382.5X3.5  [FA238V]
Q203  ABM8G-12.000MHZ-18-D2Y-T  FA2382.5X3.5  [FA238V]
R201  0  R-US_R0402  [R0402]
R202  33k  R-US_R0402  [R0402]
R203  1.5k  R-US_R0402  [R0402]
R204  22k  R-US_R0805  [R0805]
R205  1.2K  R-US_R0805  [R0805]
R206  680  R-US_R0805  [R0805]
R207  47k  R-US_R0402  [R0402]
R208  680k  R-US_R0402  [R0402]
R209  1k  R-US_R0402  [R0402]
R210  24K  R-US_R0805  [R0805]
R211  10k  R-US_R0402  [R0402]
R212  1.0  R-US_R0402  [R0402]
R213  1k  R-US_R0402  [R0402]
R214  1.0  R-US_R0402  [R0402]
R215  0  R-US_R0402  [R0402]
R216  10k  R-US_R0402  [R0402]
R217  1k  R-US_R0402  [R0402]
R218  10k  R-US_R0402  [R0402]
R219  47k  R-US_R0402  [R0402]
R220  1k  R-US_R0402  [R0402]
R221  1k  R-US_R0402  [R0402]
R222  18k  R-US_R0805  [R0805]
R223  18k  R-US_R0805  [R0805]
R224  10k  R-US_R0402  [R0402]
R225  47k  R-US_R0402  [R0402]
R226  47k  R-US_R0402  [R0402]
R227  47k  R-US_R0402  [R0402]
R228  47k  R-US_R0402  [R0402]
R229  22ohm  R-US_R0402  [R0402]
R230  22ohm  R-US_R0402  [R0402]
U$201  PJ040DM  [PJ040]
U$202  SS14-E3/5AT  SS14-E3  [DO214AC]
U$203  FSI-140-03-G-D-M-AD-TR  FSI120E  [FSI-110-03-X-D-E-AD]
U$204  PINHD-2X4-050  [2X04/90-050]
U$205  MAX4996  [TQFN24-EP]
X201  009176002  [009176002]

### Nets
1WIRE: IC207.5(1WIRE) ; also sheet 1
1WSCL: IC203.51(P5_4/UCB1SOMI/UCB1SCL) IC207.3(SCL) R223.2
1WSDA: IC203.42(P3_7/UCB1SIMO/UCB1SDA) IC207.2(SDA) R222.2
2.4V: IC203.9(P5_0/VREF+/VEREF+) ; also sheet 1
!1WRST!: IC203.52(P5_5/UCB1CLK/UCA1STE) IC207.1(SLPZ)
!CS1!: IC203.43(P4_0/TB0) ; also sheet 1
!CS2!: IC203.44(P4_1/TB1) ; also sheet 1
!CS3!: IC203.45(P4_2/TB2) ; also sheet 1
!CS4!: IC203.46(P4_3/TB3) ; also sheet 1
!DRDY!: IC203.24(P1_7) ; also sheet 1
!PD!: IC203.41(P3_6/UCB1STE/UCA1CLK) ; also sheet 1
!RESET!: IC203.30(P2_5) ; also sheet 1
!RST!: C203.1 IC203.96(RST/NMI/SBWTDIO) R219.2 U$204.P$7
!TESTZ!: IC203.8(P7_7/A15) ; also sheet 1
+3V3: IC201.4(V+) IC202.5(OUT) IC203.11(AVCC) IC203.16(DVCC1) IC203.38(DVCC3) IC203.87(DVCC4) IC207.6(VCC) J201.8 R202.2 R216.1 R218.1 R219.1 R222.1 R223.1 U$204.P$3 U$205.14(V+) U$205.15(ENABLE) ; also sheet 1
ACLK: IC203.84(P11_0/ACLK) ; also sheet 1
AGND: C201.2 IC202.2(GND) R211.2 R215.1 U$205.13(V-) U$205.EXP(GND) X201.2 ; also sheet 1
BAT2: R212.2 ; also sheet 1
BATTERY: IC204.1(IN) IC205.1(IN) R210.1 R214.1 X201.1
BOOTALFAT: IC203.75(P9_7) IC206.23(MOSI)
BT_GOOD: IC203.33(P3_0/UCB0STE/UCA0CLK) U$203.19
BTCTS: U$203.15 U$205.8(NC1)
BTRTS: IC203.17(P1_0/TA0CLK/ACLK) U$203.17
BTRXDS: IC203.40(P3_5/UCA0RXD/UCA0SOMI) U$203.16 U$205.7(NC2)
BTTXD: IC203.39(P3_4/UCA0TXD/UCA0SIMO) U$203.18
BTVCC: C206.1 C207.1 C208.1 IC204.5(OUT) U$203.3 U$203.4
CHG: C201.1 IC203.68(P9_0/UCB2STE/UCA2CLK) U$201.P$3 ; also sheet 1
DGND: C202.2 C203.2 C204.2 C205.2 C206.2 C207.2 C208.2 C209.2 C210.2 C211.2 C212.2 C213.2 C214.2 C215.2 C216.2 IC201.2(V-) IC203.10(P5_1/VREF-/VEREF-) IC203.12(AVSS) IC203.15(DVSS1) IC203.37(DVSS3) IC203.63(DVSS2) IC203.88(DVSS4) IC204.2(GND) IC205.2(GND) IC206.12(VSS1) IC206.18(VSS2) IC206.24(WP) IC206.63(VSS3) IC207.4(GND) J201.3 J202.G$1(NC0) J202.G$2(NC1) J202.G$3(NC2) J202.G$4(NC3) J202.P$6(VSS) J202.S$2(SW2) LI_CHG.3(TIMER) LI_CHG.EXP(GND) R205.1 R206.1 R208.2 R215.2 R224.1 U$201.P$2 U$203.1 U$203.2 U$204.P$1 ; also sheet 1
ELECTRODES+: IC203.6(P7_5/A13) ; also sheet 1
ENBT: IC203.32(P2_7/ADC12CLK/DMAE0) IC204.3(EN)
ENMEAS: IC203.5(P7_4/A12) ; also sheet 1
ENSD: IC203.26(P2_1/TA1.0) IC205.3(EN)
EVENT: IC203.22(P1_5/TA0.4) J201.2 R218.2
GREEN: J201.4 R221.2
HAT1: IC203.76(P10_0/UCB3STE/UCA3CLK) ; also sheet 1
HAT2: IC203.77(P10_1/UCB3SIMO/UCB3SDA) ; also sheet 1
HAT3: IC203.78(P10_2/UCB3SOMI/UCB3SCL) ; also sheet 1
IRDATA: IC203.73(P9_5/UCA2RXD/UCA2SOMI) J201.9
N$2: IC202.1(IN) IC202.3(EN) LI_CHG.1(BAT) R212.1 R214.2 ; also sheet 1
N$3: R201.1 U$201.P$1
N$4: R201.2 U$202.A
N$35: IC201.5(OUT) IC203.18(P1_1/TA0.0)
N$42: IC206.40(SD_D1) J202.P$8(DAT1) R227.2
N$47: IC201.6(SHDN) IC203.19(P1_2/TA0.1)
N$56: C202.1 IC201.3(+IN) R203.1 R208.1
N$57: Q201.B R204.2 R207.1
N$66: C209.1 IC203.62(VCORE)
N$67: IC203.48(P4_5/TB5) R221.1
N$68: IC206.28(BOOT1) R224.2
N$89: CR201.2 IC203.13(P7_0/XIN)
N$91: C212.1 IC206.6(OSC_OUT) Q203.3
N$94: CR201.1 IC203.14(P7_1/XOUT)
N$98: C210.1 IC206.5(OSC_IN) Q203.1
N$100: C216.1 IC206.47(VCAP2)
N$101: C215.1 IC206.31(VCAP1)
N$102: IC206.51(SD_D2) J202.P$1(DAT2) R225.1
N$103: IC206.52(SD_D3) J202.P$2(DAT3/CD) R226.1
N$105: IC206.54(SD_CMD) J202.P$3(CMD)
N$106: LI_CHG.9(PROG) R205.2
N$108: IC206.53(SD_CLK) J202.P$5(CLK)
N$110: IC206.39(SD_D0) J202.P$7(DAT0) R228.2
N$113: LI_CHG.6(!C/5) LI_CHG.10(VCC) Q201.E R204.1 U$202.C
N$116: IC203.49(P4_6/TB6) R220.1
N$117: IC203.53(P5_6/UCA1TXD/UCA1SIMO) U$205.24(NO2)
N$118: C205.1 IC203.89(P5_2/XT2IN) Q202.1
N$121: IC203.1(P6_4/A4) R210.2 R211.1
N$122: C204.1 IC203.90(P5_3/XT2OUT) Q202.3
N$124: IC203.56(P7_3/TA1.2) U$203.A7 U$205.3(CB)
N$125: LI_CHG.5(!CHRG) R207.2
N$135: LI_CHG.8(IDET) R206.2
N$161: IC206.45(USB0_DP) R229.1
N$162: IC206.44(USB0_DM) R230.2
NOCARD: IC203.69(P9_1/UCB2SIMO/UCB2SDA) IC206.25(NO_CARD) J202.S$1(SW1)
ONOFF: IC203.21(P1_4/TA0.3) J201.1 R216.2
RALFAT: IC203.74(P9_6) IC206.7(!RESET!)
RECLED: IC203.20(P1_3/TA0.2) R217.2
RECORDING: J201.10 R217.1
RED: J201.5 R220.2
REFTAP: IC203.7(P7_6/A14) ; also sheet 1
RMEAS: IC203.98(P6_1/A1) IC203.100(P6_3/A3) ; also sheet 1
SCLK: IC203.36(P3_3/UCB0CLK/UCA0STE) ; also sheet 1
SDCTS: IC206.22(CTS/MISO) U$205.5(COM1)
SDCTSU: IC203.23(P1_6/SMCLK) U$205.23(NO1)
SDRXD: IC203.54(P5_7/UCA1RXD/UCA1SOMI) IC206.42(UART_TX)
SDTXDS: IC206.43(UART_RX) U$205.6(COM2)
SDVCC: C211.1 C213.1 C214.1 IC205.5(OUT) IC206.1(VBAT/RTC) IC206.13(VDD1) IC206.19(VDD2) IC206.32(VDD3) IC206.48(VDD4) IC206.64(VDD5) J202.P$4(+3V3) R225.2 R226.2 R227.1 R228.1
SIMO: IC203.34(P3_1/UCB0SIMO/UCB0SDA) ; also sheet 1
SOMI: IC203.35(P3_2/UCB0SOMI/UCB0SCL) ; also sheet 1
SQWN: IC203.28(P2_3/TA1.2) ; also sheet 1
SQWP: IC203.27(P2_2/TA1.1) ; also sheet 1
START: IC203.29(P2_4/RTCCLK) ; also sheet 1
STROBE: IC201.1(-IN) J201.7 R202.1 R203.2
SW_0: IC203.70(P9_2/UCB2SOMI/UCB2SCL) U$203.12
SW_1: IC203.71(P9_3/UCB2CLK/UCA2STE) U$203.13
TCK: IC203.95(PJ_3/TCK) U$204.P$8
TDI: IC203.93(PJ_1/TDI/TCLK) U$204.P$4
TDO: IC203.92(PJ_0/TDO) U$204.P$2
TEST: IC203.91(TEST/SBWTCK) U$204.P$5
TESTRXD: IC203.81(P10_5/UCA3RXD/UCA3SOMI) ; also sheet 1
TESTTXD: IC203.80(P10_4/UCA3TXD/UCA3SIMO) ; also sheet 1
TMS: IC203.94(PJ_2/TMS) U$204.P$6
USB0N: R230.1 ; also sheet 1
USB0P: R229.2 ; also sheet 1
YELDR: IC203.72(P9_4/UCA2TXD/UCA2SIMO) R213.2
YELLOW: J201.6 R209.1 R213.1
YLBC: Q201.C R209.2
ZAD0: IC203.57(P8_0/TA0.0) ; also sheet 1
ZAD1: IC203.58(P8_1/TA0.1) ; also sheet 1
ZAD2: IC203.59(P8_2/TA0.2) ; also sheet 1
ZAD3: IC203.60(P8_3/TA0.3) ; also sheet 1
ZAD4: IC203.61(P8_4/TA0.4) ; also sheet 1
ZMEAS: IC203.97(P6_0/A0) IC203.99(P6_2/A2) ; also sheet 1
Unconnected: IC202.4(NC/FB) IC203.2(P6_5/A5) IC203.3(P6_6/A6) IC203.4(P6_7/A7) IC203.25(P2_0/TA1CLK/MCLK) IC203.31(P2_6/ACLK) IC203.47(P4_4/TB4) IC203.50(P4_7/TBCLK/SMCLK) IC203.55(P7_2/TBOUTH/SVMOUT) IC203.65(P8_5/TA1.0) IC203.66(P8_6/TA1.1) IC203.67(P8_7) IC203.79(P10_3/UCB3CLK/UCA3STE) IC203.82(P10_6) IC203.83(P10_7) IC203.85(P11_1/MCLK) IC203.86(P11_2/SMCLK) IC204.4(NC/FB) IC205.4(NC/FB) IC206.2(NC) IC206.3(OSC32KHZ_IN) IC206.4(OSC32KHZ_OUT) IC206.8(USB_PHY_STP) IC206.9(NC1) IC206.10(USB_PHY_DIR) IC206.11(USB_PHY_NXT) IC206.14(WAKEUP) IC206.15(NC2) IC206.16(NC3) IC206.17(USB_PHY_D0) IC206.20(ACTIVE) IC206.21(USB_PHY_CK) IC206.26(USB_PHY_D1) IC206.27(USB_PHY_D2) IC206.29(USB_PHY_D3) IC206.30(USB_PHY_D4) IC206.33(USB_PHY_D5) IC206.34(USB_PHY_D6) IC206.35(USB1_DM) IC206.36(USB1_DP) IC206.37(NC4) IC206.38(NC5) IC206.41(19.2MHZ) IC206.46(NC6) IC206.49(NC7) IC206.50(SPI_SEL) IC206.55(SPI_CLK) IC206.56(NC8) IC206.57(USB_PHY_D7) IC206.58(I2C_SCL) IC206.59(I2C_SDA) IC206.60(BOOT0) IC206.61(NC9) IC206.62(NC10) LI_CHG.2(IN+) LI_CHG.4(OUT) LI_CHG.7(!EN) Q202.2 Q202.4 Q203.2 Q203.4 U$203.5 U$203.6 U$203.7 U$203.8 U$203.9 U$203.10 U$203.11 U$203.14 U$203.20 U$203.A1 U$203.A2 U$203.A3 U$203.A4 U$203.A5 U$203.A6 U$203.A8 U$203.A9 U$203.A10 U$203.A11 U$203.A12 U$203.A13 U$203.A14 U$203.A15 U$203.A16 U$203.A17 U$203.A18 U$203.A19 U$203.A20 U$205.1(CB) U$205.2(CB) U$205.4(COM2) U$205.9(NC2) U$205.10(NC1) U$205.11(NC2) U$205.12(NC1) U$205.16(COM1) U$205.17(COM2) U$205.18(COM1) U$205.19(NO1) U$205.20(NO2) U$205.21(NO1) U$205.22(NO2)

### Notes on the sheet
- Schottky Diode
- VISHAY SS14-E3/61T
- DNP
- Abracon ABM8G-14.7456MHz | Alt 22.1184MHz
- 14.7456 MHz
- AVX/Kyocera CX3225GB14.7456
- 12.000MHz
- Strobe Detector
- BT
- High for Shutdown
- For sending
  to Bluetooth
- BlueTooth Connector
- © 2013 Bio-Signal Group Corp.
- Brooklyn NY
- EEG1308-2 | 1.0

## Power pins joined to a net without a drawn wire
DVCC2: IC203.64(DVCC2)

## Library data of the parts
C101-C148 C201-C216 = resistor:C-US: CAPACITOR, American symbol
CR201 = crystal:FC-12M: kHz RANGE CRYSTAL UNIT LOW PROFILE SMD Source: Epson Toyocom FC-12M.pdf
IC101 = analog-devices:AD823: High-Speed, Low-Power J-FET input Dual Operational Amplifier Source: http://www.analog.com/static/imported-files/data_sheets/AD826.pdf
IC102 = BSG7702:LMP7702: Operational Amplifier; MF: TEXAS INSTRUMENTS; MPN: LMP7702MA
IC103 = BSG7708:LMP7708: Operational Amplifier; MF: TEXAS INSTRUMENTS; MPN: LMP7708MA
IC201 = tlv350x_10:TLV3501AI*: 4.5ns Rail-to-Rail, High-Speed Comparator - Single Source: http://www.ti.com/lit/ds/symlink/tlv3501.pdf; MF: Texas Instruments; MPN: TLV3501AIDBV; OC_FARNELL: 1903403; OC_NEWARK: 43K4126
IC202 IC204 IC205 = BSG:TPS73233: 250-mA LOW-DROPOUT LINEAR REGULATORS 250-mA Low-Dropout Regulator Source: http://focus.ti.com/lit/ds/symlink/tps73201.pdf; MF: TEXAS INSTRUMENTS; MPN: TPS73233DBVT; OC_FARNELL: 8461554; OC_NEWARK: 77C1171
IC203 = texas:MSP430F54*: MIXED SIGNAL MICROCONTROLLER Auto generated by make-symbol-device-package-bsdl.ulp Rev. 27 Source: www.ti.com .. msp430f5437.pdf; MPN: MSP430F5438IPZ; OC_FARNELL: 1740340; OC_NEWARK: 77R3126
IC206 = BSG:STM32F205R: BASE FOR ALFAT COPROCESSOR; OC_FARNELL: unknown; OC_NEWARK: unknown
IC207 = maxim:MAX6342: RESET CIRCUIT; OC_FARNELL: unknown; OC_NEWARK: unknown
J201 = con-wurth:687110183622
J202 = BSG:MICROSD_HOLDER: Molex 104031
LI_CHG = linear-technology:LTC4062: Standalone Linear Li-Ion Battery Charger with Micropower Comparator Source: http://www.linear.com .. 4062fa.pdf; MPN: LTC4062EDD#PBF; OC_FARNELL: 1648037; OC_NEWARK: 58M0900
Q201 = transistor-pnp:BC857*: PNP Transistror
Q202 Q203 = crystal:FA238: MHz RANGE CRYSTAL UNIT Source: Epson Toyocom
R101-R118 R201-R209 R211-R221 R224-R230 = resistor:R-US_: RESISTOR, American symbol
R210 R222 R223 = rcl:R-US_: RESISTOR, American symbol
RN101-RN125 = resistor-net:CTS742C083: Chip Resistor Array 4 Single Resistor Source: http://www.ctscorp.com/components/Datasheets/CTSChipArrayDs.pdf; OC_FARNELL: unknown; OC_NEWARK: unknown
U101 U103 U104 U106 = BSG:ADS1298_PAG_64; DATASHEETURL: http://www.ti.com/lit/gpn/ADS1298; DESCRIPTION: 8-Channel, 24-Bit Analog-To-Digital Converter With Integrated ECG Front End; FAMILY_NAME: ECG / EEG Analog Front End; GENERIC_PART_NUMBER: ADS1298; INDUSTRY_STD_PKG_TYPE: TQFP; MANUFACTURER: Texas Instruments; PACKAGE_DESIGNATOR: PAG; PIN_COUNT: 64
U102 = BSG:ADG732BSUZ
U105 = DG4052EEN-T1-GE4:DG4052EEN-T1-GE4: DG4052E Series 16 V 78 Ohm High Precision CMOS Analog Multiplexer - miniQFN-16; DESCRIPTION: DG4052E Series 16 V 78 Ohm High Precision CMOS Analog Multiplexer - miniQFN-16; DIGI-KEY_PART_NUMBER: DG4052EEN-T1-GE4CT-ND; DIGI-KEY_PURCHASE_URL: https://www.digikey.com/product-detail/en/vishay-siliconix/DG4052EEN-T1-GE4/DG4052EEN-T1-GE4CT-ND/9860937?utm_source=snapeda&utm_medium=aggregator&utm_campaign=symbol; MF: Vishay; MP: DG4052EEN-T1-GE4; PACKAGE: WFQFN-16 Vishay
U$101 U$102 U$104 U$107 U$108 U$111-U$114 U$117 U$118 U$120 U$122-U$126 = BSG:CAP-AVX05084
U$103 U$105 U$106 U$109 U$110 U$115 U$116 U$119 U$121 = maxim3:TVSMAX3208E: TVS QUAD BIDIRECTIONAL DIODES WITH ZENER
U$127 = BSGcon:PNLRECEPT
U$128 U$129 = con-jack:TOUCHPRUF
U$130 = texas:TPS22942
U$131 U$205 = maxim:MAX4996
U$201 = con-jack:PJ040DM
U$202 = diode:SS14-E3
U$203 = BSG7702:FSI120E
U$204 = pinhead:PINHD-2X4-050
X201 = con-avx:00917?002: Wire to Board Strip IDC Connector 2 WAY Source: http://www.avx.com/docs/Catalogs/9176.pdf http://www.avx.com/docs/Catalogs/9177.pdf; MPN: 009176002001006; OC_FARNELL: 1582834; OC_NEWARK: 66M1960